# Altium schematic sheet Accesoire antenne et buzzer.SchDoc: ANTENNE BLUETOOTH/BUZZER
size A4; DrawnBy: TORIBIO Alexis; Address4: 4; DocumentNumber: 4/6; Revision: V5.0 REV.A; SheetNumber: 4; SheetTotal: 6
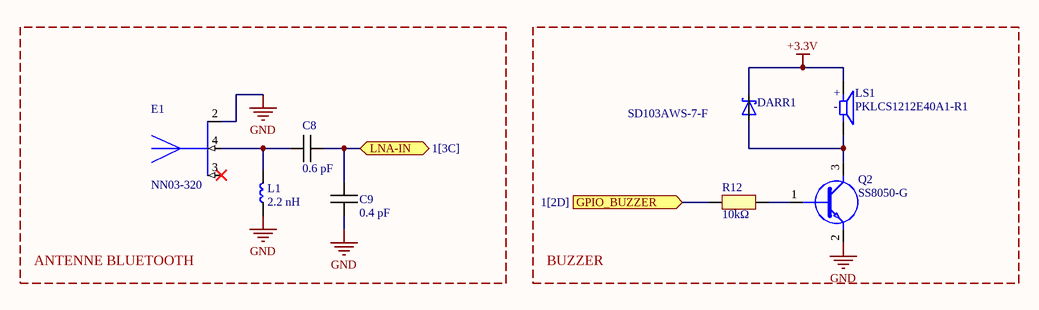
[diagram p0: Accesoire antenne et buzzer.SchDoc]

## Parts
C8  0.6 pF  [CAPC1005X06N]
C9  0.4 pF  [CAPC1005X06N]
DARR1  SD103AWS-7-F  [SD103AWS-7-F]
E1  NN03-320  [XCVR_NN03-320]
L1  2.2 nH  [LQPC1005X06N]
LS1  PKLCS1212E40A1-R1  [SPKR_PKLCS1212E40A1-R1]
Q2  SS8050-G  [SS8050-G]
R12  10kΩ  [RESC1005X06N]

## Blocks framed on the sheet
ANTENNE BLUETOOTH: C8 C9 E1 L1
BUZZER: DARR1 LS1 Q2 R12

## Ports
GPIO_BUZZER (in, see 1[2D]), LNA-IN (bidir, see 1[3C])

## Nets
+3.3V: DARR1.1(C) LS1.P
GND: C9.2 E1.2(GROUND) L1.1 Q2.2(E)
GPIO_BUZZER: R12.1 ; port GPIO_BUZZER
LNA-IN: C8.1 C9.1 ; port LNA-IN
NetC8_2: C8.2 E1.4(FEED_GNSS) L1.2
NetDARR1_2: DARR1.2(A) LS1.N Q2.3(C)
NetQ2_1: Q2.1(B) R12.2

Not connected (* = marked no-connect by the designer): E1 3(FEED_BLUETOOTH)*

## Notes on the sheet
- (in symbol PKLCS1212E40A1-R1) +; -

## Library data of the parts
C8 C9 = Capacitor
DARR1 = SD103AWS-7-F: Diode Array 3 Independent Schottky 40V 175mA Surface Mount 6-TSSOP, SC-88, SOT-363
E1 = NN03-320: Dual port antenna booster for GNSS, Bluetooth, 5G and UWB (1561 - 1606MHz, 2400 - 2500MHz, 3400 - 3800MHz, 3100 - 4800MHz and 6000 - 10600 MHz), signal booster; Manufacturer_Name: Ignion; Manufacturer_Part_Number: NN03-320; Mouser Part Number: 128-NN03-320
L1 = Bobine
LS1 = PKLCS1212E40A1-R1: Buzzers Transducer, Externally Driven Piezo 1.5V 2kHz 70dB @ 1.5V, 10cm Surface Mount Solder Pads; MF: Murata Electronics; Value: *; MP: PKLCS1212E40A1-R1; Package: None; Availability: Unavailable; Price: None
Q2 = SS8050-G: Bipolar Transistors - BJT NPN TRANSISTOR 1.5A 40V
R12 = Resistor